# EAGLE design 5v-power (EAGLE 6.5.0)
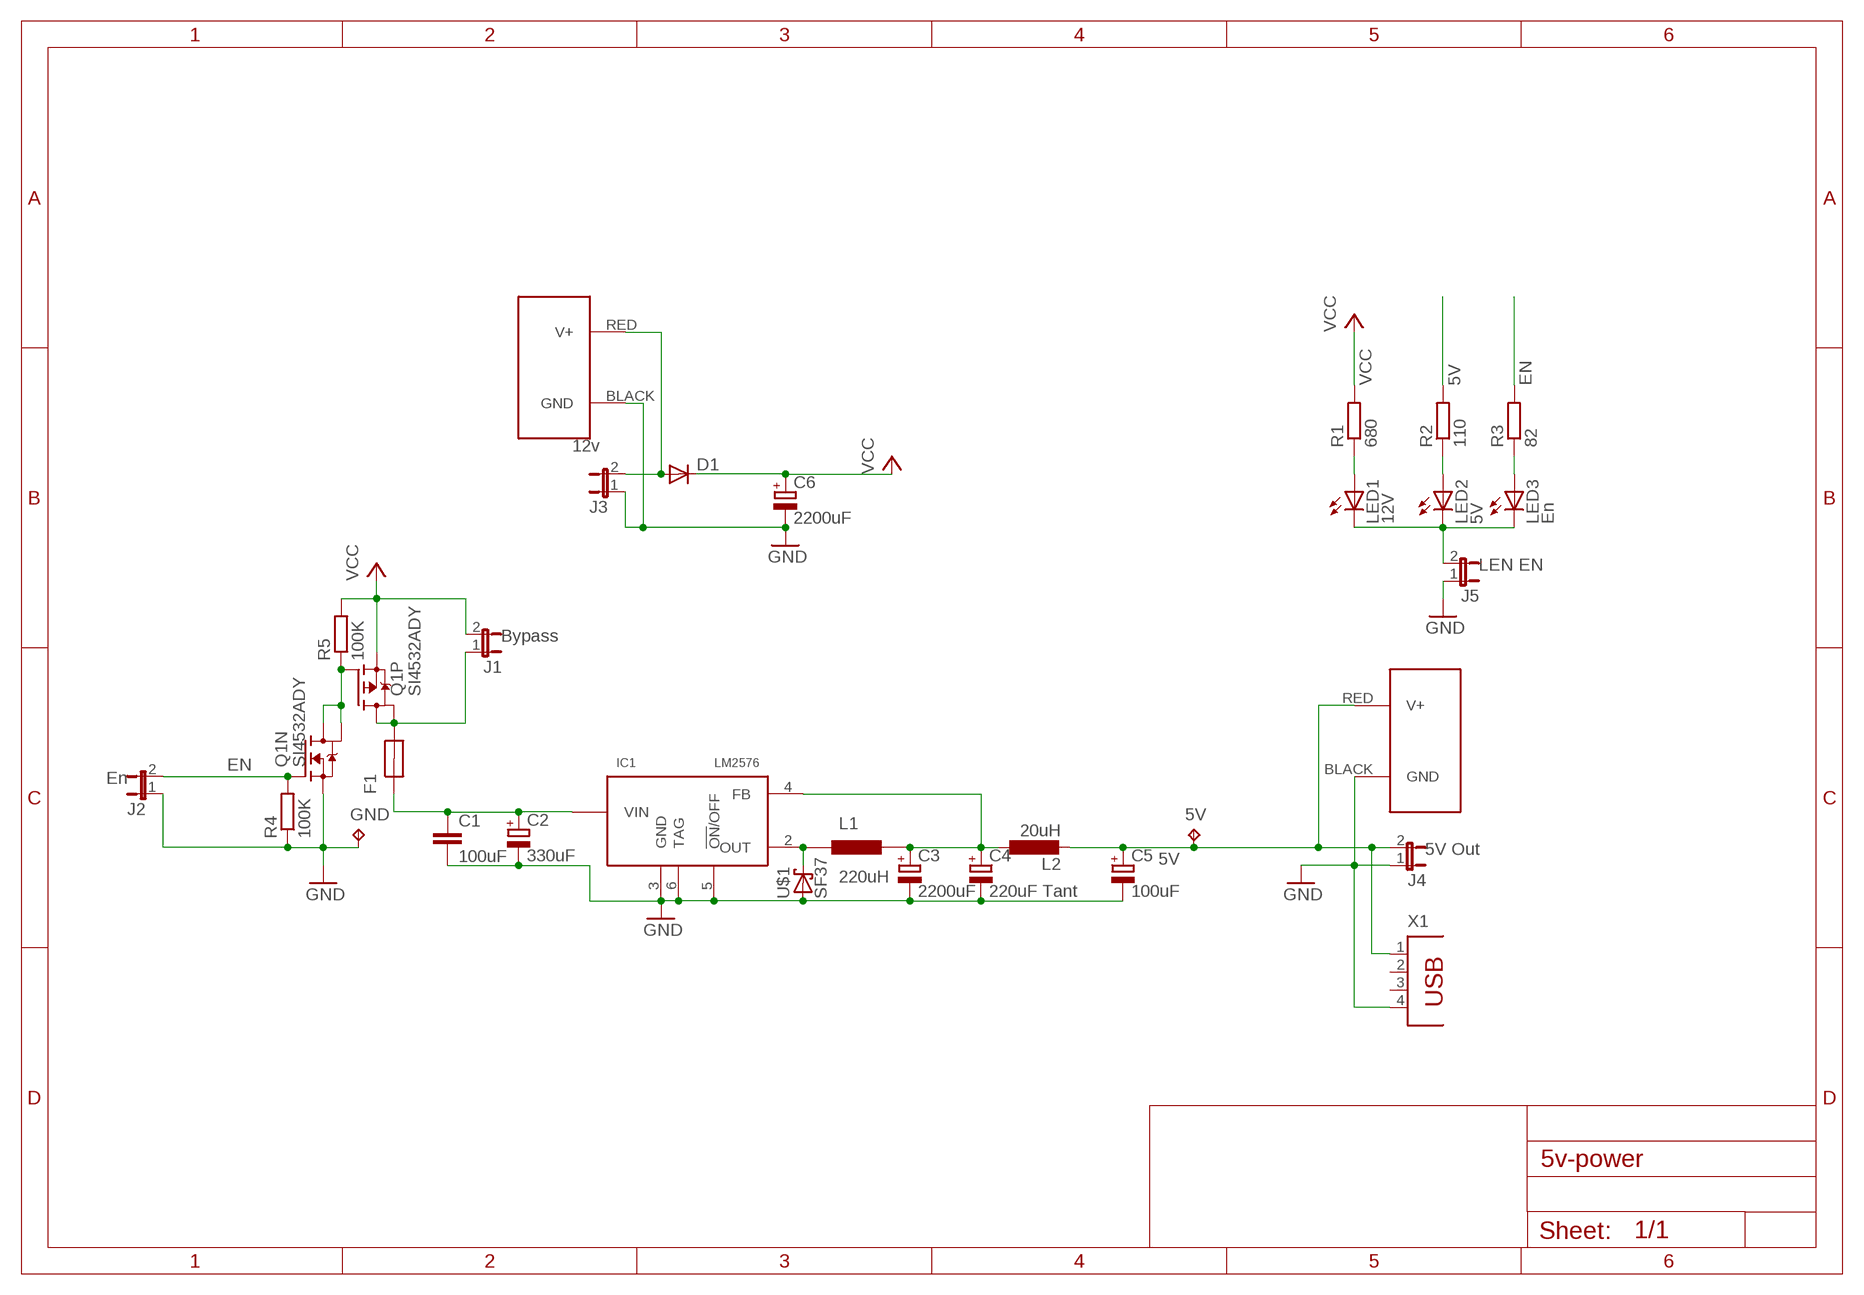
[diagram p0: schematic, sheet 1]

## Parts
5V  5V B  TPB1,27  [B1,27]
C1  100uF  C-EUC1210K  [C1210K]
C2  330uF  CPOL-EUE5-8.5  [E5-8,5]
C3  2200uF  CPOL-EUE5-13  [E5-13]
C4  220uF Tant  CPOL-EUB/3528-21R  [B/3528-21R]
C5  100uF  CPOL-EUE  [PANASONIC_E]
C6  2200uF  CPOL-EUE5-13  [E5-13]
D1  DIODE-SMB  [SMB]
F1  MF-MSMF110  [1812]
GND  5V B  TPB1,27  [B1,27]
IC1  LM2576  [TO263]
J1  Bypass  2-PIN-MOLEX  [2-MOLEX]
J2  En  2-PIN-MOLEX  [2-MOLEX]
J3  12v  2-PIN-MOLEX  [2-MOLEX]
J4  5V Out  2-PIN-MOLEX  [2-MOLEX]
J5  LEN EN  2-PIN-MOLEX  [2-MOLEX]
J6  POWERPOLE_POWER10AWG  [POWERPOLE_PAIR_10AWG]
J7  POWERPOLE_POWER10AWG  [POWERPOLE_PAIR_10AWG]
L1  220uH  DR127-221-R  [DR127]
L2  20uH  L-EU6000-XXX-RC  [6000-XXXX-RC]
LED1  12V  LEDCHIP-LED0805  [CHIP-LED0805]
LED2  5V  LEDCHIP-LED0805  [CHIP-LED0805]
LED3  En  LEDCHIP-LED0805  [CHIP-LED0805]
Q1  SI4532ADY  [SO8]
R1  680  R-EU_R0805  [R0805]
R2  110  R-EU_R0805  [R0805]
R3  82  R-EU_R0805  [R0805]
R4  100K  R-EU_R0805  [R0805]
R5  100K  R-EU_R0805  [R0805]
U$1  SF37  [DO-201AD]
X1  PN87520  [PN87520]

## Nets
5V: 5V.TP C5.+ J4.2 J6.RED(V+) L2.2 R2.2 X1.1
EN: J2.2 Q1.2(N:G) R3.2 R4.2
GND: C1.2 C2.- C3.- C4.- C5.- C6.- GND.TP IC1.3(GND) IC1.5(!ON!/OFF) IC1.6(TAG) J2.1 J3.1 J4.1 J5.1 J6.BLACK(GND) J7.BLACK(GND) Q1.1(N:S) R4.1 U$1.2(A) X1.4
LEDGND: J5.2 LED1.C LED2.C LED3.C
N$1: D1.A J3.2 J7.RED(V+)
N$2: LED1.A R1.1
N$25: Q1.4(P:G) Q1.7(N:D) Q1.8(N:D) R5.1
N$47: LED2.A R2.1
N$74: LED3.A R3.1
N$95: F1.2 J1.1 Q1.5(P:D) Q1.6(P:D)
N$103: C3.+ C4.+ IC1.4(FB) L1.2 L2.1
N$104: IC1.2(OUT) L1.1 U$1.1(C)
VCC: C6.+ D1.C J1.2 Q1.3(P:S) R1.2 R5.2
VCC_HP2_SW: C1.1 C2.+ F1.1 IC1.1(VIN)
Unconnected: X1.2 X1.3

## Library data of the parts
5V GND = testpad:TP: Test pad
C1 = resistor:C-EU: CAPACITOR, European symbol
C2-C6 = rcl:CPOL-EU: POLARIZED CAPACITOR, European symbol
D1 = diode:DIODE-: DIODE
F1 = farnell-parts:MF-MSMF110
IC1 = farnell-parts:LM2576
J1-J5 = farnell-parts:2-PIN-MOLEX
J6 J7 = powerpoles:POWERPOLE_POWER: Anderson Powerpole Power Connector using ameteur radio standard layout
L1 = farnell-parts:DR127-221-R
L2 = rcl:L-EU: INDUCTOR, European symbol
LED1-LED3 = led:LED: LED OSRAM: - CHIPLED LG R971, LG N971, LY N971, LG Q971, LY Q971, LO R971, LY R971 LH N974, LH R974 LS Q976, LO Q976, LY Q976 LO Q996 - Hyper CHIPLED LW Q18S LB Q993, LB Q99A, LB R99A - SideLED LS A670, LO A670, LY A670, LG A670, LP A670 LB A673, LV A673, LT A673, LW A673 LH A674 LY A675 LS A676, LA A676, LO A676, LY A676, LW A676 LS A679, LY A679, LG A679 - Hyper Micro SIDELED® LS Y876, LA Y876, LO Y876, LY Y876 LT Y87S - SmartLED LW L88C, LW L88S LB L89C, LB L89S, LG L890 LS L89K, LO L89K, LY L89K LS L896, LA L896, LO L896, LY L896 - TOPLED LS T670, LO T670, LY T670, LG T670, LP T670 LSG T670, LSP T670, LSY T670, LOP T670, LYG T670 LG T671, LOG T671, LSG T671 LB T673, LV T673, LT T673, LW T673 LH T674 LS T676, LA T676, LO T676, LY T676, LB T676, LH T676, LSB T676, LW T676 LB T67C, LV T67C, LT T67C, LS T67K, LO T67K, LY T67K, LW E67C LS E67B, LA E67B, LO E67B, LY E67B, LB E67C, LV E67C, LT E67C LW T67C LS T679, LY T679, LG T679 LS T770, LO T770, LY T770, LG T770, LP T770 LB T773, LV T773, LT T773, LW T773 LH T774 LS E675, LA E675, LY E675, LS T675 LS T776, LA T776, LO T776, LY T776, LB T776 LHGB T686 LT T68C, LB T68C - Hyper Mini TOPLED® LB M676 - Mini TOPLED Santana® LG M470 LS M47K, LO M47K, LY M47K Source: http://www.osram.convergy.de LUXEON: - LUMILED® LXK2-PW12-R00, LXK2-PW12-S00, LXK2-PW14-U00, LXK2-PW14-V00 LXK2-PM12-R00, LXK2-PM12-S00, LXK2-PM14-U00 LXK2-PE12-Q00, LXK2-PE12-R00, LXK2-PE12-S00, LXK2-PE14-T00, LXK2-PE14-U00 LXK2-PB12-K00, LXK2-PB12-L00, LXK2-PB12-M00, LXK2-PB14-N00, LXK2-PB14-P00, LXK2-PB14-Q00 LXK2-PR12-L00, LXK2-PR12-M00, LXK2-PR14-Q00, LXK2-PR14-R00 LXK2-PD12-Q00, LXK2-PD12-R00, LXK2-PD12-S00 LXK2-PH12-R00, LXK2-PH12-S00 LXK2-PL12-P00, LXK2-PL12-Q00, LXK2-PL12-R00 Source: www.luxeon.com KINGBRIGHT: KA-3528ASYC Source: www.kingbright.com
Q1 = basestation:SI4532ADY: N and P MOSFETS
R1-R5 = resistor:R-EU_: RESISTOR, European symbol
U$1 = farnell-parts:SF37
X1 = con-berg:PN87520: BERG USB connector; OC_FARNELL: unknown; OC_NEWARK: unknown

## Board
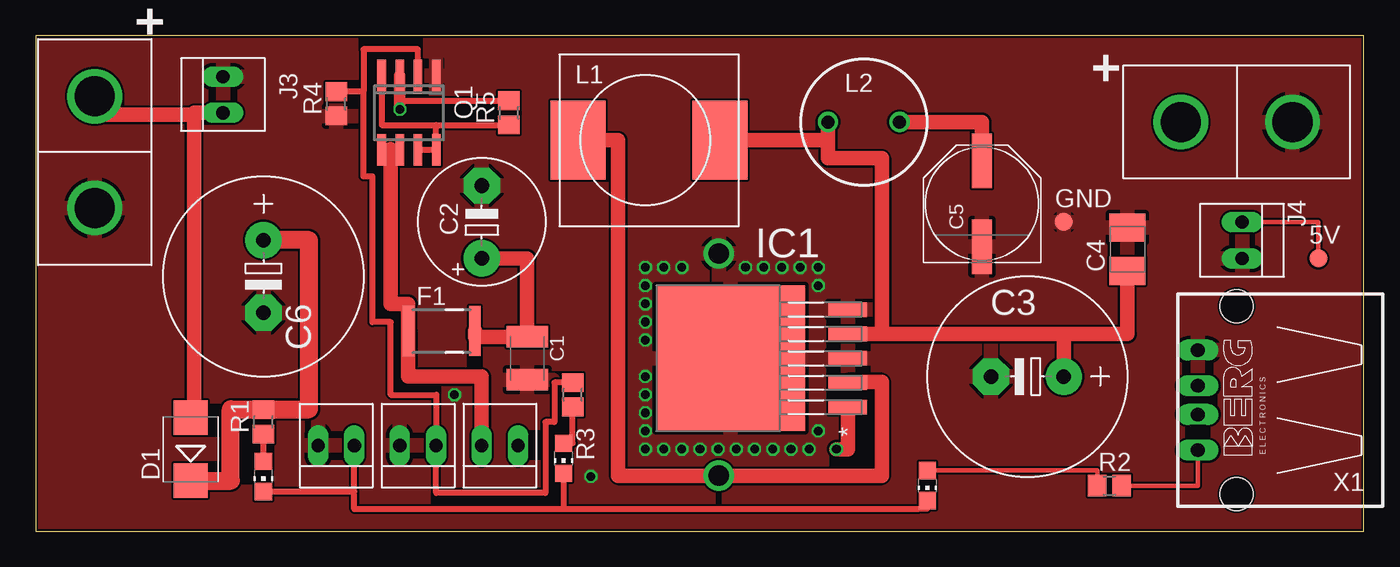
[diagram p1: board, top side]
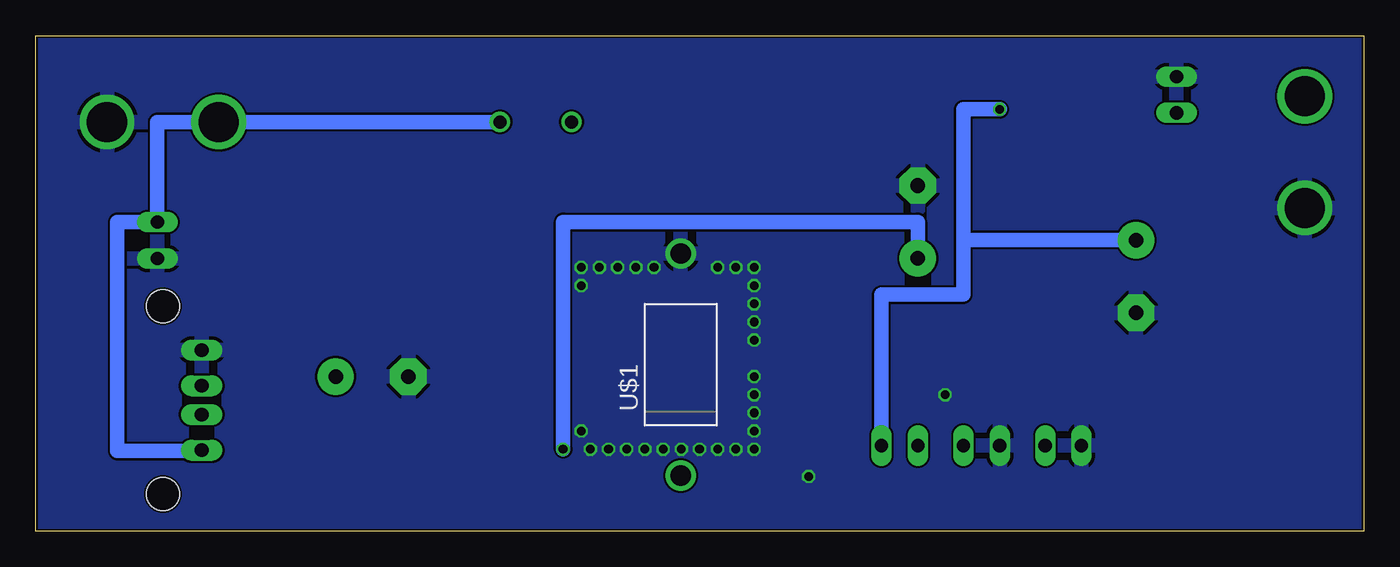
[diagram p2: board, bottom side, seen from below]

Size 92.71 x 34.6 mm. Coordinates in mm from the lower left corner, seen from the top.
Outline: 0,0 92.71,0 92.71,34.6 0,34.6 0,0
Copper layers (1*16): Top 0.035mm / dielectric 1.5mm / Bottom 0.035mm
Design rules "Hackvana": minimum track width 6mil, minimum drill 0.3mm, track to track 6mil, track to pad 6mil, pad to pad 6mil, via to via 6mil, smd to smd 0mil, copper to edge 6mil, drill to drill 6mil, minimum pad ring 10mil, minimum via ring 6mil, stop-mask expansion 2mil, vias tented up to drill 100mil, thermal gap 10mil

### Footprints (pad centres in the part's own frame; a part is rotated, then mirrored left to right if it is on the bottom)
B1,27 = smd 1.27 x 1.27: TP 0,0
C1210K = smd 1.5 x 2.9: 1 -1.5,0; 2 1.5,0
E5-8,5 = drill 1.016 pad 2.54: + -2.54,0 | drill 1.016 pad 2.54 octagon: - 2.54,0
E5-13 = drill 1.016 pad 2.54: + -2.54,0 | drill 1.016 pad 2.54 octagon: - 2.54,0
B/3528-21R = smd 1.95 x 2.5: + 1.525,0; - -1.525,0
PANASONIC_E = smd 3.8 x 1.4: + 3,0; - -3,0
SMB = smd 2.4 x 2.4: A 2.2,0; C -2.2,0
1812 = smd 0.8 x 3.5: 1 -1.425,0; 2 3.225,0
TO263 = smd 1.016 x 2.692: 1 -3.404,-9.042; 2 -1.702,-9.042; 3 0,-9.042; 4 1.702,-9.042; 5 3.404,-9.042 | smd 10.16 x 10.41: 6 0,-0.848
2-MOLEX = drill 0.914 long: 1 -1.27,-0.381; 2 1.27,-0.381
POWERPOLE_PAIR_10AWG = drill 2.8: BLACK 3.9,0; RED -3.9,0
DR127 = smd 3.85 x 5.5: 1 -4.7,0; 2 5.2,0
6000-XXXX-RC = drill 0.9 pad 1.422: 1 -2.5,0; 2 2.5,0
CHIP-LED0805 = smd 1.2 x 1.2: A 0,-1.05; C 0,1.05
SO8 = smd 0.6 x 2.2: 1 -1.905,-2.6; 2 -0.635,-2.6; 3 0.635,-2.6; 4 1.905,-2.6; 5 1.905,2.6; 6 0.635,2.6; 7 -0.635,2.6; 8 -1.905,2.6
R0805 = smd 1.3 x 1.5: 1 -0.85,0; 2 0.85,0
DO-201AD = drill 1.4: 1 -12,-2.5; 2 3.5,-2.5
PN87520 = drill 0.95 long: 1 -3.5,2.71; 2 -1,2.71; 3 1,2.71; 4 3.5,2.71 | hole 2.3: -6.57,0; 6.57,0

### Placement (x,y rotation side)
5V  89.55,19.05 0 top
C1  34.3,12.07 270 top
C2  31.13,21.59 90 top
C3  69.23,10.8 180 top
C4  76.22,19.69 270 top
C5  66.06,22.86 90 top
C6  15.89,17.78 270 top
D1  10.81,5.72 90 top
F1  29.23,13.97 180 top
GND  71.77,21.59 0 top
IC1  47.64,12.07 90 top
J1  32.4,6.35 0 top
J2  26.69,6.35 0 top
J3  13.45,30.48 270 top
J4  83.84,20.32 90 top
J5  20.97,6.35 0 top
J6  83.84,28.58 0 top
J7  4.11,26.47 270 top
L1  42.56,27.3 0 top
L2  57.8,28.58 0 top
LED1  15.89,3.81 180 top
LED2  62.24,3.18 180 top
LED3  36.84,5.08 180 top
Q1  26.05,29.21 180 top
R1  15.89,7.62 90 top
R2  74.94,3.18 0 top
R3  37.48,9.52 90 top
R4  20.97,29.84 90 top
R5  33.03,29.21 90 top
U$1  50.18,15.88 90 bottom
X1  83.84,9.14 90 top

### Tracks (layer width: path | path; a pad name or v marks a point on that pad's centre or on a via)
5V
  Top 0.305: R2.2 81.12,3.18 X1.1 | 5V.TP 89.55,21.59 J4.2
  Top 1.016: C5.+ 66.06,28.58 L2.2
  Bottom 1.016: L2.2 J6.RED 84.22,28.58 J4.2 87.01,21.59 87.01,5.59 81.12,5.59 X1.1
EN
  Top 0.406: 22.88,30.7 22.88,24.77 23.51,24.77 23.51,14.61 24.78,14.61 24.78,9.52 27.95,9.52 J2.2 27.95,2.67 35.57,2.67 35.57,7.62 36.21,7.62 36.21,10.38 R3.2 | 22.88,30.7 R4.2 | Q1.2 26.69,33.66 22.88,33.66 22.88,30.7
GND  (via drill 0.6)
  other vias: 53.99,5.72 52.72,5.72 51.45,5.72 50.18,5.72 48.91,5.72 47.64,5.72 46.37,5.72 45.1,5.72 43.83,5.72 42.56,5.72 42.56,6.98 42.56,8.26 42.56,9.52 42.56,10.8 42.56,13.34 42.56,14.61 42.56,15.88 42.56,17.15 42.56,18.41 43.83,18.41 45.1,18.41 49.54,18.41 50.82,18.41 52.09,18.41 53.35,18.41 54.62,18.41 54.62,17.15 54.62,6.98 38.75,3.81 29.23,9.52
  pour Bottom: -34.91,94.62 159.4,94.62 159.4,-57.78 -34.91,-57.78
  pour Top: -29.83,90.81 151.78,90.81 151.78,-51.44 -29.83,-51.44
LEDGND
  Top 0.305: 61.61,1.52 62.24,1.52 LED2.C
  Top 0.406: 61.61,1.52 36.84,1.52 | 36.84,1.52 22.24,1.52 22.24,2.76 | 22.24,2.76 J5.2 | LED3.C 36.84,1.52 | LED1.C 22.24,2.76
N$1
  Top 1.016: D1.A 11.06,7.91 11.06,29.08 | 11.06,29.08 11.06,29.21 J3.2 | J7.RED 4.11,29.08 11.06,29.08
N$2
  Top 0.406: LED1.A R1.1
N$25
  Top 0.406: Q1.7 Q1.8 27.95,28.36 | 27.95,28.36 R5.1 | Q1.4 24.14,28.36 27.95,28.36
N$47
  Top 0.305: LED2.A 74.09,4.23 R2.1
N$74
  Top 0.406: LED3.A 37.48,6.13 R3.1
N$95
  Top 0.61: Q1.5 24.14,26.67 24.78,26.67 25.41,26.67 Q1.6
  Top 1.016: J1.1 31.13,10.8 26,10.8 F1.2 26,15.88 24.78,15.88 24.78,26.67
N$103
  Top 1.016: IC1.4 59.07,13.77 | 59.07,13.77 71.77,13.77 | 71.77,13.77 C3.+ | 59.07,13.77 59.07,26.04 55.3,26.04 L2.1 55.3,27.3 L1.2 | 71.77,13.77 76.22,13.77 C4.+
N$104
  Top 1.016: IC1.2 56.68,10.41 59.07,10.41 59.07,3.88 U$1.1 40.65,3.88 40.66,27.3 L1.1
VCC  (via drill 0.6)
  Top 0.406: Q1.3 25.41,30.06 R5.2
  Top 0.813: v25.41,29.46 Q1.3
  Top 1.27: D1.C 13.6,3.52 13.6,8.51 15.89,8.51 | 15.89,8.51 R1.2 | 15.89,8.51 19.06,8.51 19.06,20.32 C6.+
  Bottom 1.016: C6.+ 27.95,20.32 | 27.95,20.32 27.95,29.46 v25.41,29.46 | J1.2 33.67,16.51 27.95,16.51 27.95,20.32
VCC_HP2_SW  (via drill 0.6)
  Top 1.016: IC1.1 56.68,5.72 v55.9,5.72 | C2.+ 34.3,19.05 C1.1 30.65,13.57 F1.1
  Bottom 1.016: v55.9,5.72 55.9,21.59 31.13,21.59 C2.+

### Text on the board
tDocu: Switched 5V | Version 0.2 | PJB